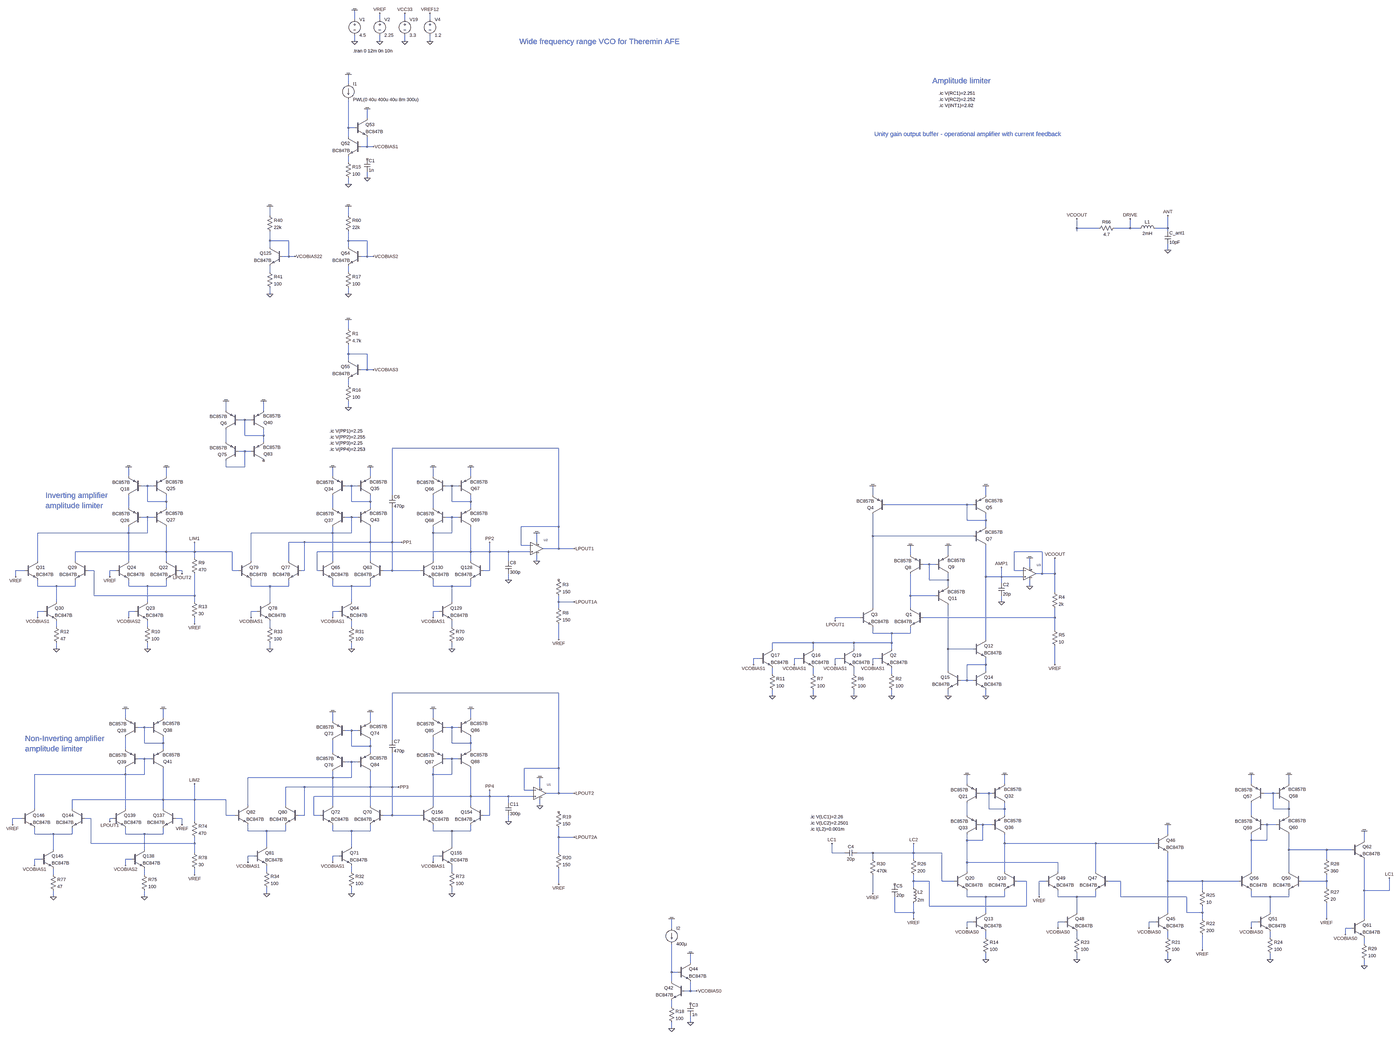
[diagram p0: schematic vco_sine_bjt_v09.asc, whole sheet]
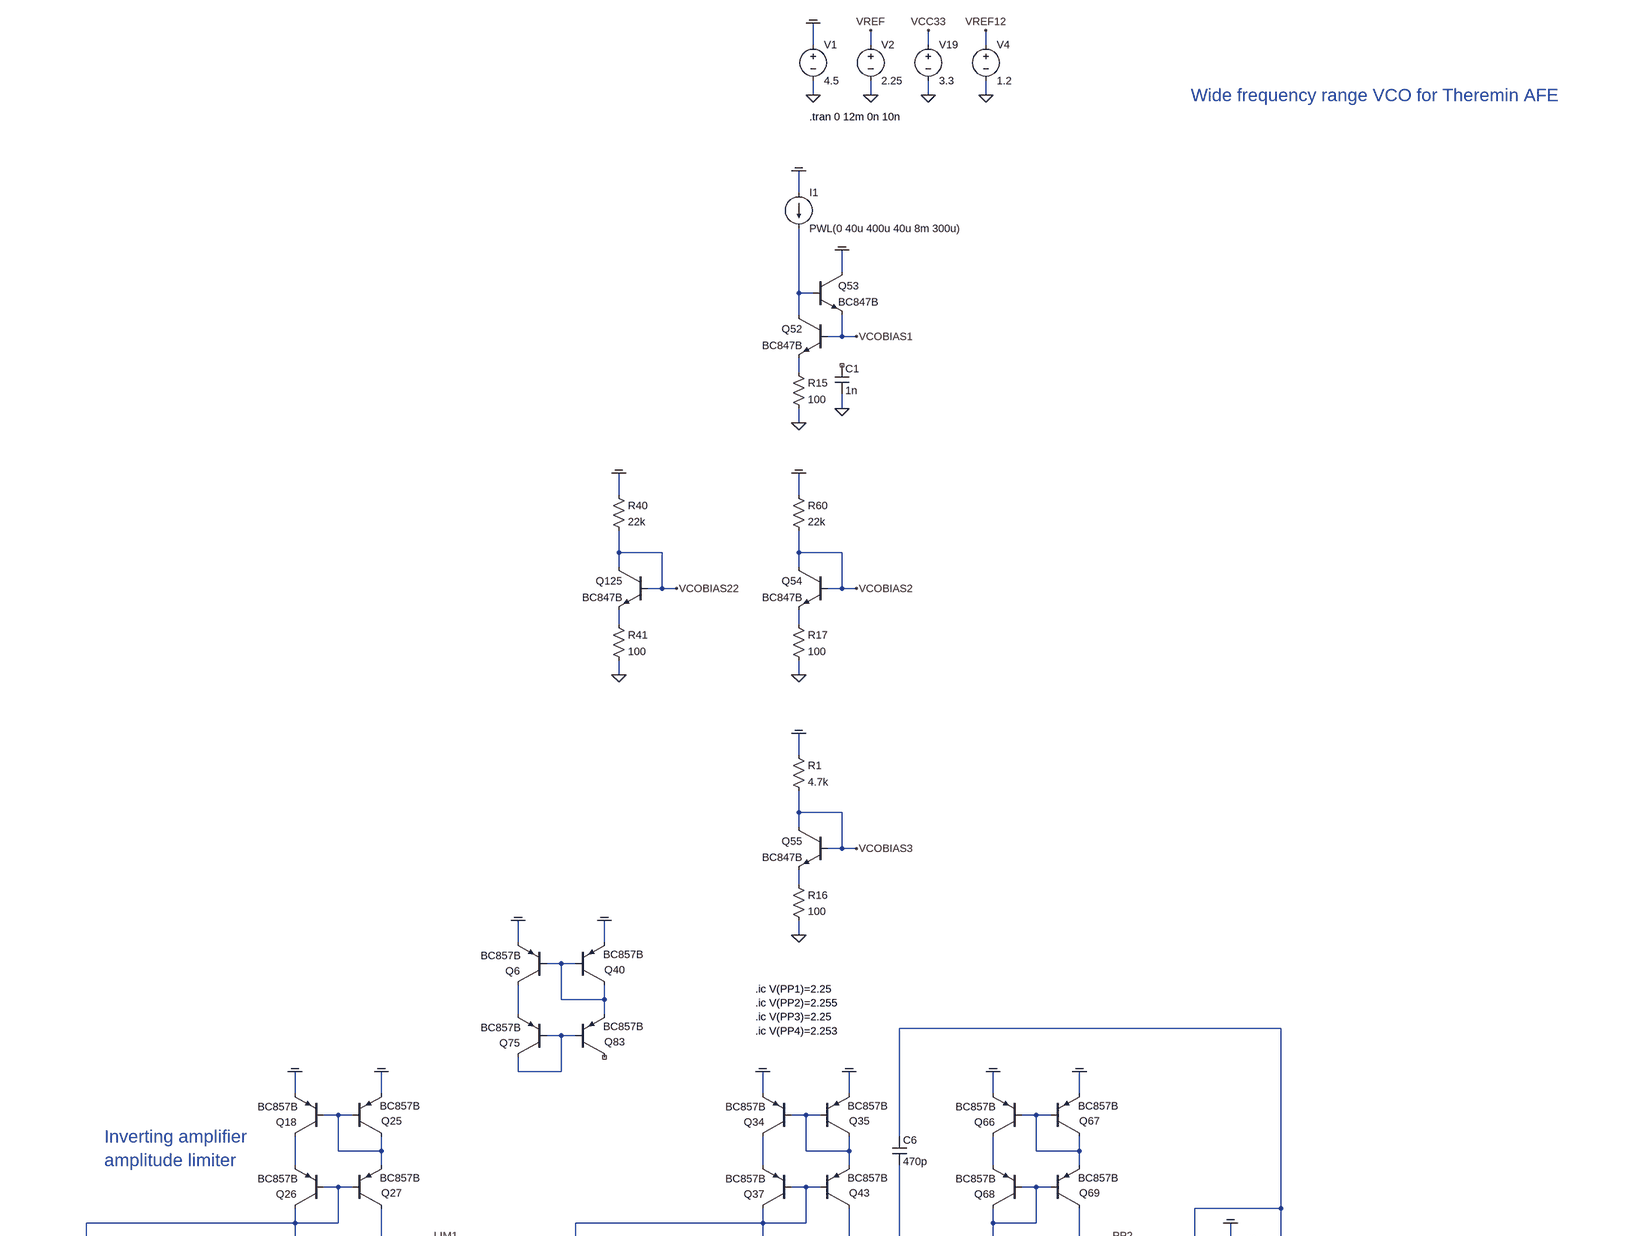
[diagram p1: schematic vco_sine_bjt_v09.asc, part, row 1 of 2, column 1 of 2]
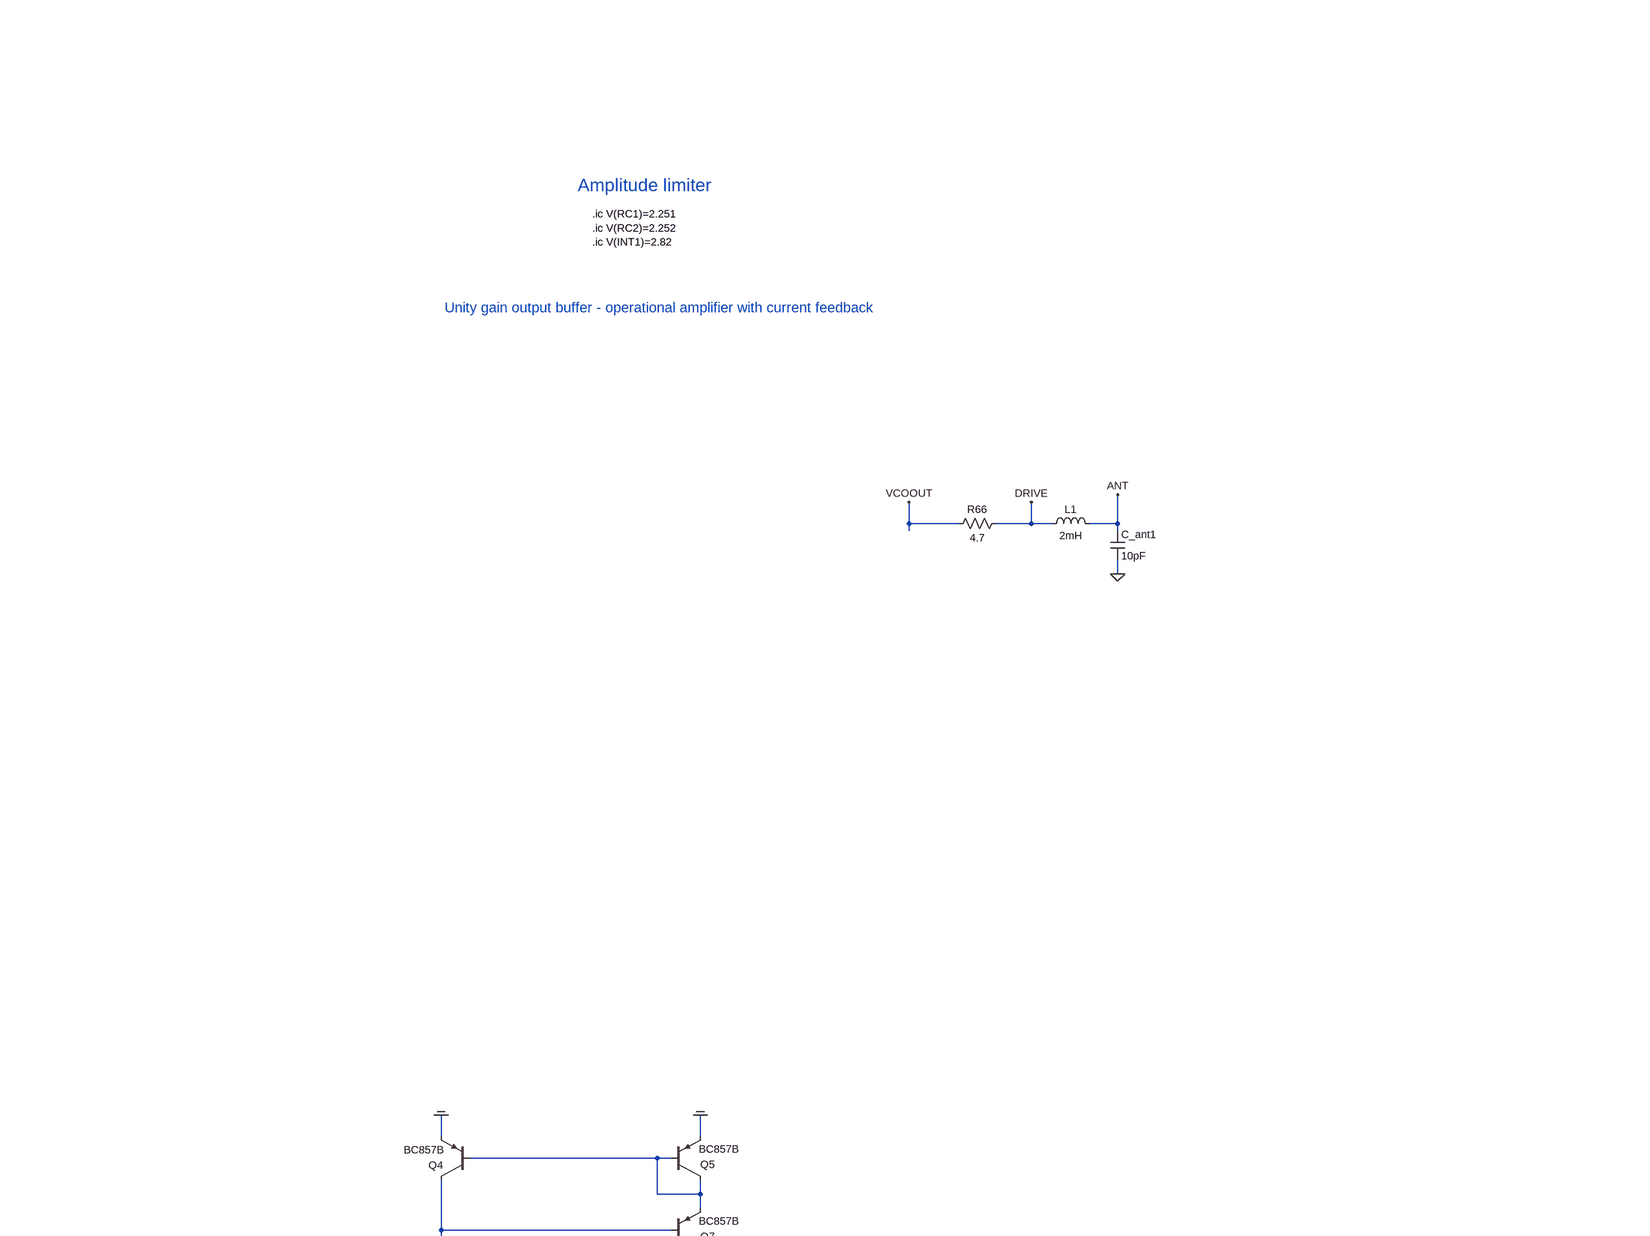
[diagram p2: schematic vco_sine_bjt_v09.asc, part, row 1 of 2, column 2 of 2]
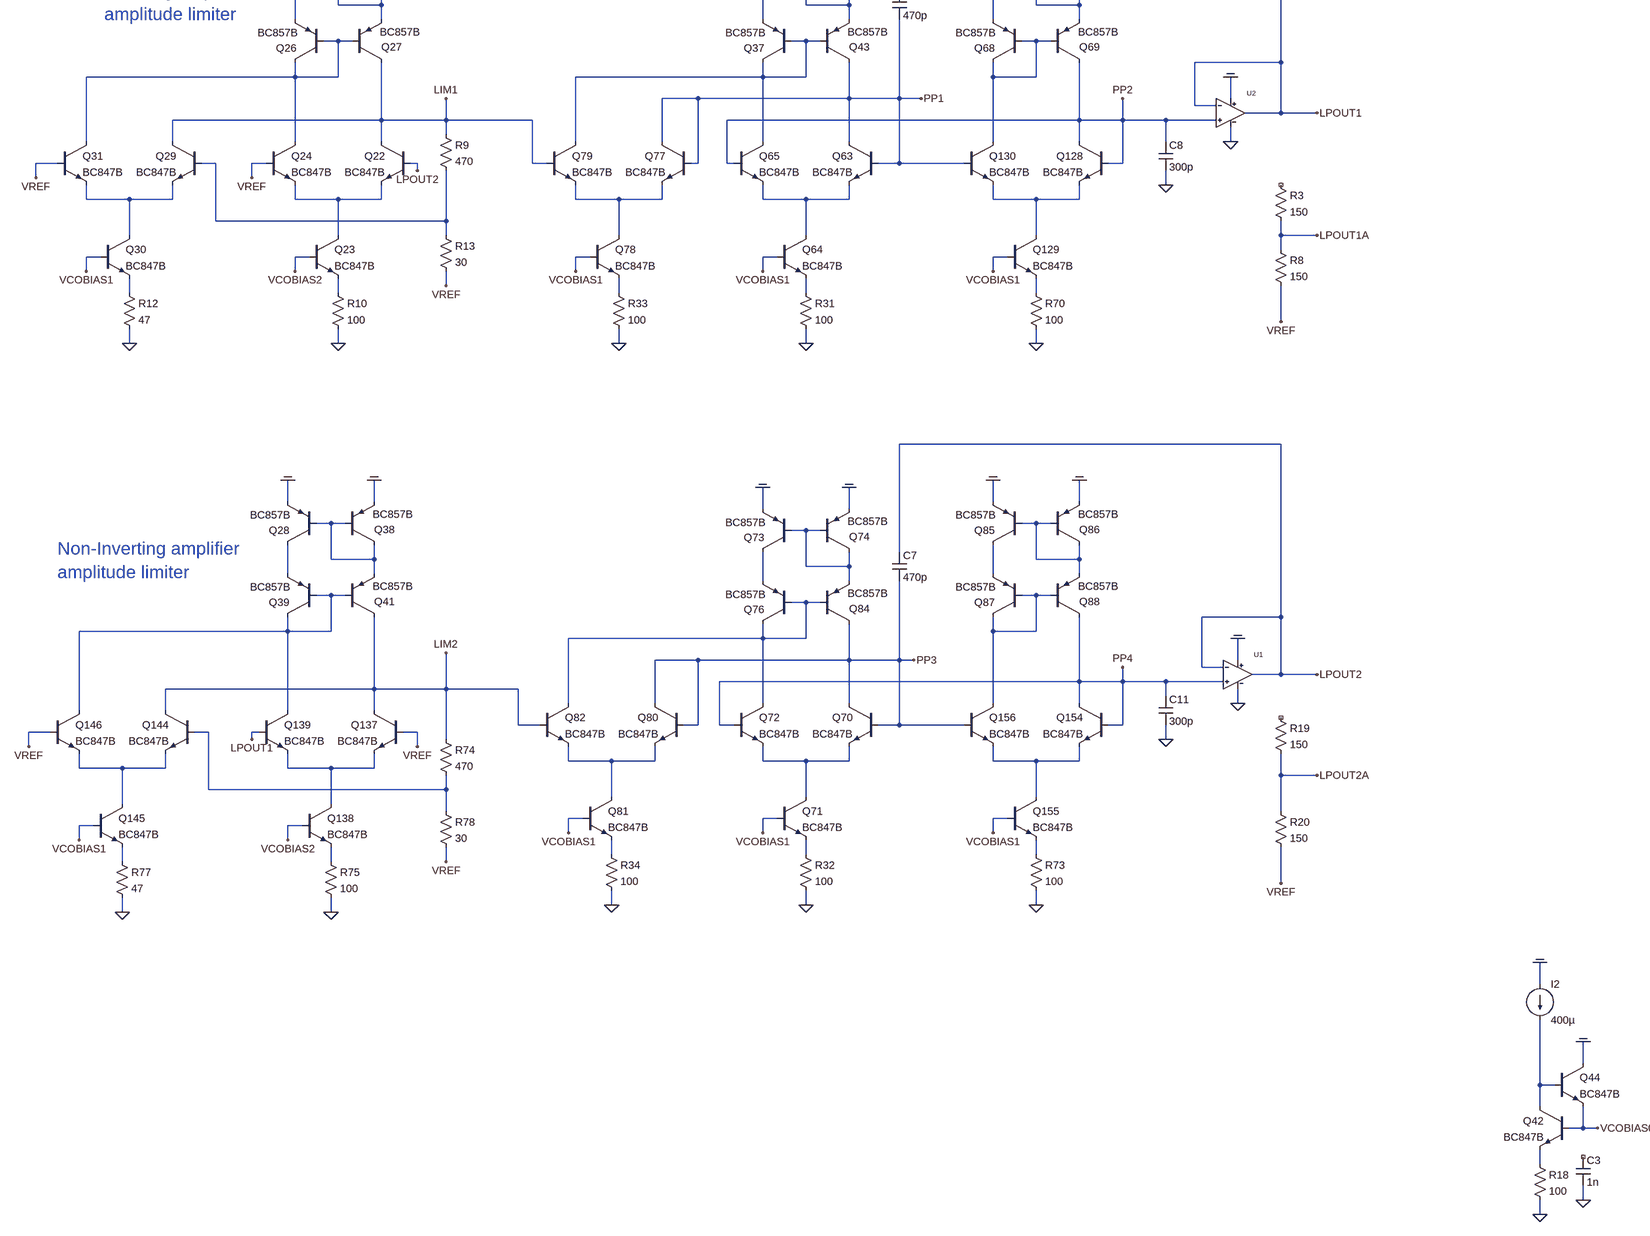
[diagram p3: schematic vco_sine_bjt_v09.asc, part, row 2 of 2, column 1 of 2]
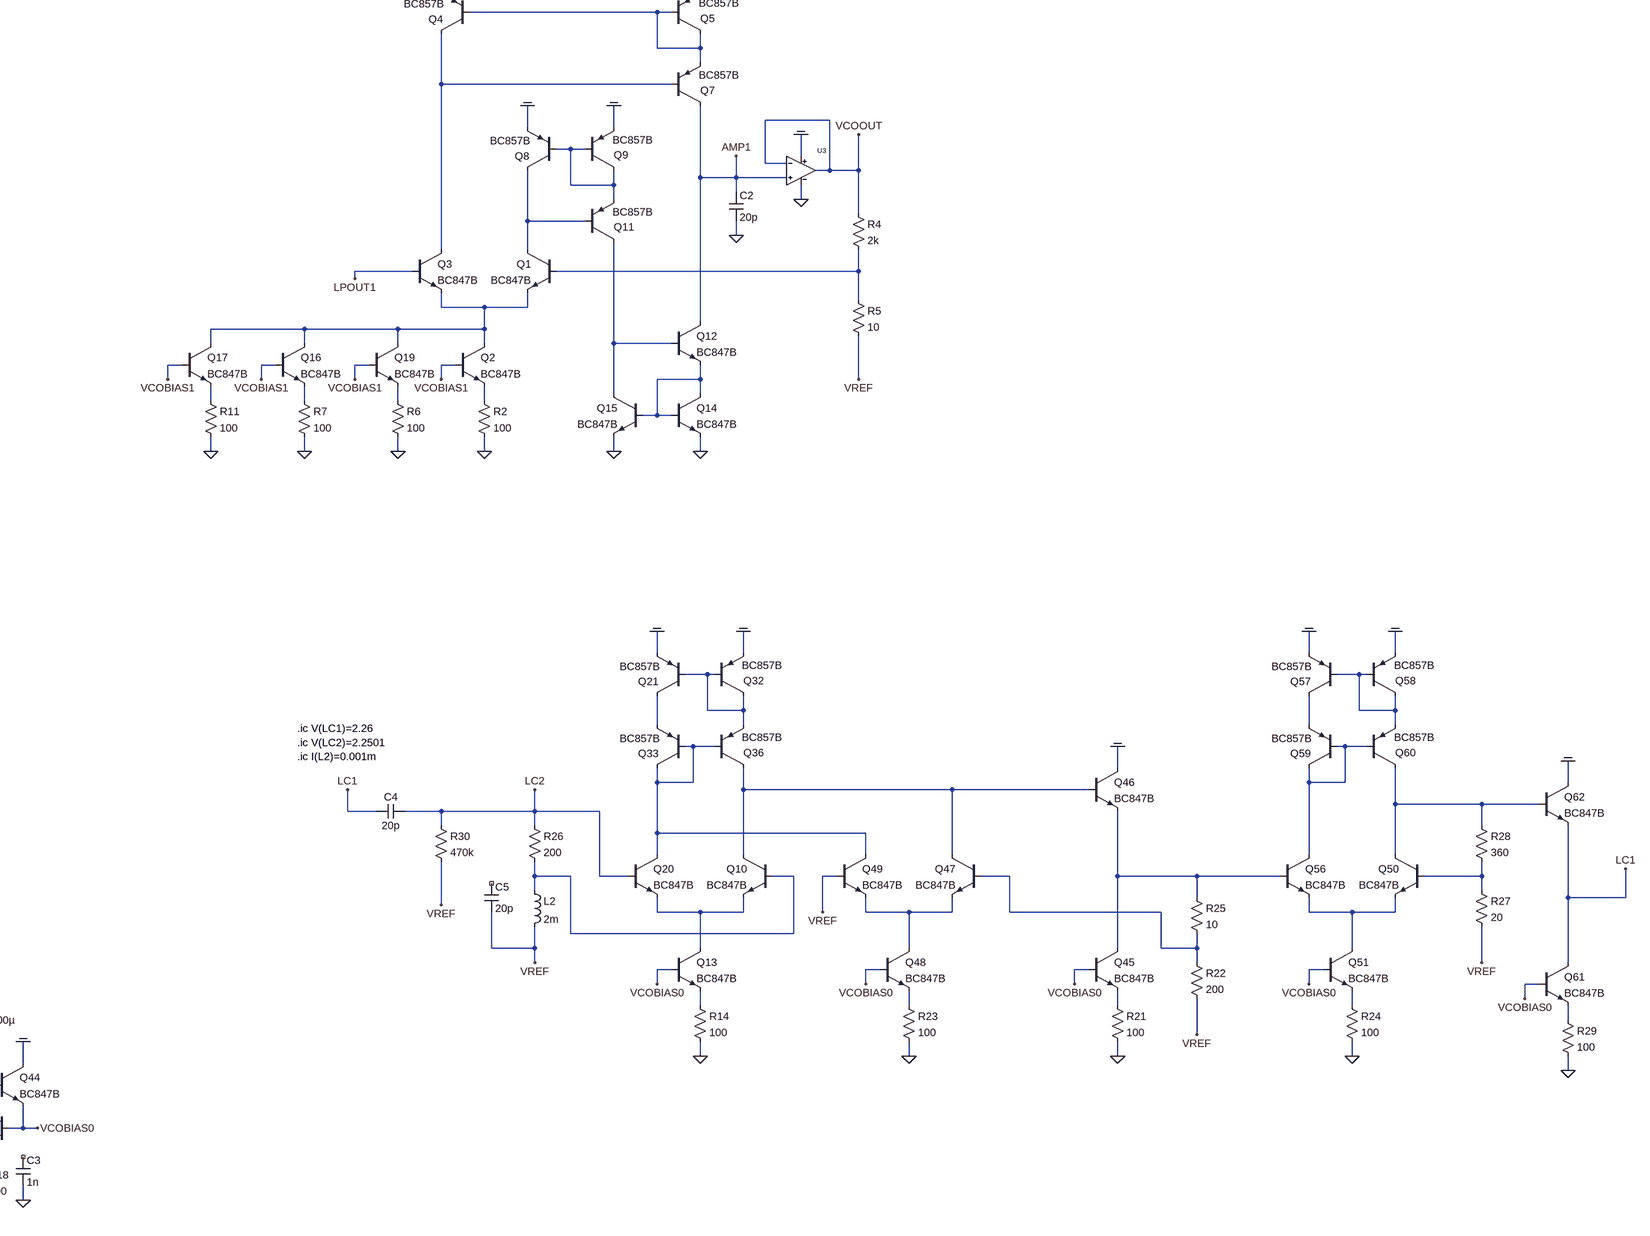
[diagram p4: schematic vco_sine_bjt_v09.asc, part, row 2 of 2, column 2 of 2]
vco_sine_bjt_v09.asc, the LTspice schematic file:
Version 4
SHEET 1 13504 19328
WIRE -432 13600 -432 13552
WIRE -304 13600 -304 13568
WIRE -176 13600 -176 13568
WIRE -48 13600 -48 13568
WIRE -432 13712 -432 13680
WIRE -304 13712 -304 13680
WIRE -176 13712 -176 13680
WIRE -48 13712 -48 13680
WIRE -464 14000 -464 13952
WIRE -368 14176 -368 14128
WIRE -464 14224 -464 14080
WIRE -432 14224 -464 14224
WIRE -464 14272 -464 14224
WIRE -368 14320 -368 14272
WIRE -368 14320 -400 14320
WIRE -336 14320 -368 14320
WIRE -464 14400 -464 14368
WIRE -368 14480 -368 14448
WIRE -464 14512 -464 14480
WIRE -864 14672 -864 14624
WIRE -464 14672 -464 14624
WIRE 3536 14736 3536 14688
WIRE 3648 14736 3536 14736
WIRE 3808 14736 3808 14688
WIRE 3808 14736 3728 14736
WIRE 3856 14736 3808 14736
WIRE 4000 14736 4000 14672
WIRE 4000 14736 3936 14736
WIRE 3536 14752 3536 14736
WIRE 4000 14752 4000 14736
WIRE -864 14800 -864 14752
WIRE -768 14800 -864 14800
WIRE -464 14800 -464 14752
WIRE -368 14800 -464 14800
WIRE -864 14832 -864 14800
WIRE -464 14832 -464 14800
WIRE 4000 14848 4000 14816
WIRE -768 14880 -768 14800
WIRE -768 14880 -800 14880
WIRE -736 14880 -768 14880
WIRE -368 14880 -368 14800
WIRE -368 14880 -400 14880
WIRE -336 14880 -368 14880
WIRE -864 14960 -864 14928
WIRE -464 14960 -464 14928
WIRE -864 15072 -864 15040
WIRE -464 15072 -464 15040
WIRE -464 15280 -464 15232
WIRE -464 15408 -464 15360
WIRE -368 15408 -464 15408
WIRE -464 15440 -464 15408
WIRE -368 15488 -368 15408
WIRE -368 15488 -400 15488
WIRE -336 15488 -368 15488
WIRE -464 15568 -464 15536
WIRE -464 15680 -464 15648
WIRE -1088 15696 -1088 15648
WIRE -896 15696 -896 15648
WIRE -992 15744 -1024 15744
WIRE -960 15744 -992 15744
WIRE -992 15824 -992 15744
WIRE -896 15824 -896 15792
WIRE -896 15824 -992 15824
WIRE -1088 15856 -1088 15792
WIRE -896 15856 -896 15824
WIRE 608 15888 -240 15888
WIRE -992 15904 -1024 15904
WIRE -960 15904 -992 15904
WIRE -1088 15984 -1088 15952
WIRE -992 15984 -992 15904
WIRE -992 15984 -1088 15984
WIRE -1584 16032 -1584 15984
WIRE -1392 16032 -1392 15984
WIRE -544 16032 -544 15984
WIRE -352 16032 -352 15984
WIRE -32 16032 -32 15984
WIRE 160 16032 160 15984
WIRE -1488 16080 -1520 16080
WIRE -1456 16080 -1488 16080
WIRE -448 16080 -480 16080
WIRE -416 16080 -448 16080
WIRE 64 16080 32 16080
WIRE 96 16080 64 16080
WIRE -240 16128 -240 15888
WIRE 2496 16128 2496 16080
WIRE 3072 16128 3072 16080
WIRE -1488 16160 -1488 16080
WIRE -1392 16160 -1392 16128
WIRE -1392 16160 -1488 16160
WIRE -448 16160 -448 16080
WIRE -352 16160 -352 16128
WIRE -352 16160 -448 16160
WIRE 64 16160 64 16080
WIRE 160 16160 160 16128
WIRE 160 16160 64 16160
WIRE 2976 16176 2560 16176
WIRE 3008 16176 2976 16176
WIRE -1584 16192 -1584 16128
WIRE -1392 16192 -1392 16160
WIRE -544 16192 -544 16128
WIRE -352 16192 -352 16160
WIRE -32 16192 -32 16128
WIRE 160 16192 160 16160
WIRE -1488 16240 -1520 16240
WIRE -1456 16240 -1488 16240
WIRE -448 16240 -480 16240
WIRE -416 16240 -448 16240
WIRE 64 16240 32 16240
WIRE 96 16240 64 16240
WIRE 2976 16256 2976 16176
WIRE 3072 16256 3072 16224
WIRE 3072 16256 2976 16256
WIRE 608 16288 608 15888
WIRE 608 16288 416 16288
WIRE 3072 16288 3072 16256
WIRE -1584 16320 -1584 16288
WIRE -1584 16320 -2048 16320
WIRE -1488 16320 -1488 16240
WIRE -1488 16320 -1584 16320
WIRE -544 16320 -544 16288
WIRE -544 16320 -960 16320
WIRE -448 16320 -448 16240
WIRE -448 16320 -544 16320
WIRE -32 16320 -32 16288
WIRE 64 16320 64 16240
WIRE 64 16320 -32 16320
WIRE 2496 16336 2496 16224
WIRE 3008 16336 2496 16336
WIRE -688 16368 -768 16368
WIRE -352 16368 -352 16288
WIRE -352 16368 -688 16368
WIRE -240 16368 -240 16192
WIRE -240 16368 -352 16368
WIRE -192 16368 -240 16368
WIRE 496 16368 496 16320
WIRE 416 16384 416 16288
WIRE 464 16384 416 16384
WIRE 608 16400 608 16288
WIRE 608 16400 528 16400
WIRE 688 16400 608 16400
WIRE -1392 16416 -1392 16288
WIRE -1392 16416 -1856 16416
WIRE -1248 16416 -1248 16368
WIRE -1248 16416 -1392 16416
WIRE -1056 16416 -1248 16416
WIRE 160 16416 160 16288
WIRE 160 16416 -624 16416
WIRE 256 16416 256 16368
WIRE 256 16416 160 16416
WIRE 352 16416 256 16416
WIRE 464 16416 352 16416
WIRE 3360 16416 3216 16416
WIRE 2688 16432 2688 16384
WIRE 2880 16432 2880 16384
WIRE -1248 16448 -1248 16416
WIRE -2048 16464 -2048 16320
WIRE -1856 16464 -1856 16416
WIRE -1584 16464 -1584 16320
WIRE -1392 16464 -1392 16416
WIRE -960 16464 -960 16320
WIRE -768 16464 -768 16368
WIRE -544 16464 -544 16320
WIRE -352 16464 -352 16368
WIRE -32 16464 -32 16320
WIRE 160 16464 160 16416
WIRE 352 16464 352 16416
WIRE 496 16464 496 16432
WIRE 2784 16480 2752 16480
WIRE 2816 16480 2784 16480
WIRE 3296 16496 3296 16448
WIRE -2112 16512 -2160 16512
WIRE -1760 16512 -1792 16512
WIRE -1648 16512 -1680 16512
WIRE -1312 16512 -1328 16512
WIRE -1056 16512 -1056 16416
WIRE -1024 16512 -1056 16512
WIRE -688 16512 -688 16368
WIRE -688 16512 -704 16512
WIRE -624 16512 -624 16416
WIRE -608 16512 -624 16512
WIRE -240 16512 -240 16368
WIRE -240 16512 -288 16512
WIRE -96 16512 -240 16512
WIRE 256 16512 256 16416
WIRE 256 16512 224 16512
WIRE 3216 16512 3216 16416
WIRE 3264 16512 3216 16512
WIRE -1312 16528 -1312 16512
WIRE 3360 16528 3360 16416
WIRE 3360 16528 3328 16528
WIRE 3424 16528 3424 16448
WIRE 3424 16528 3360 16528
WIRE -2160 16544 -2160 16512
WIRE -1680 16544 -1680 16512
WIRE 3072 16544 3072 16384
WIRE 3152 16544 3152 16496
WIRE 3152 16544 3072 16544
WIRE 3264 16544 3152 16544
WIRE 352 16560 352 16528
WIRE 2784 16560 2784 16480
WIRE 2880 16560 2880 16528
WIRE 2880 16560 2784 16560
WIRE 3152 16576 3152 16544
WIRE -2048 16592 -2048 16560
WIRE -1952 16592 -2048 16592
WIRE -1856 16592 -1856 16560
WIRE -1856 16592 -1952 16592
WIRE -1584 16592 -1584 16560
WIRE -1488 16592 -1584 16592
WIRE -1392 16592 -1392 16560
WIRE -1392 16592 -1488 16592
WIRE -960 16592 -960 16560
WIRE -864 16592 -960 16592
WIRE -768 16592 -768 16560
WIRE -768 16592 -864 16592
WIRE -544 16592 -544 16560
WIRE -448 16592 -544 16592
WIRE -352 16592 -352 16560
WIRE -352 16592 -448 16592
WIRE -32 16592 -32 16560
WIRE 64 16592 -32 16592
WIRE 160 16592 160 16560
WIRE 160 16592 64 16592
WIRE 2880 16592 2880 16560
WIRE 3296 16592 3296 16560
WIRE 3424 16624 3424 16528
WIRE -1760 16640 -1760 16512
WIRE -1248 16640 -1248 16528
WIRE -1248 16640 -1760 16640
WIRE 2688 16640 2688 16528
WIRE 2816 16640 2688 16640
WIRE -1952 16672 -1952 16592
WIRE -1488 16672 -1488 16592
WIRE -1248 16672 -1248 16640
WIRE -864 16672 -864 16592
WIRE -448 16672 -448 16592
WIRE 64 16672 64 16592
WIRE 608 16672 608 16640
WIRE 688 16672 608 16672
WIRE 3152 16672 3152 16640
WIRE 608 16704 608 16672
WIRE 2496 16704 2496 16336
WIRE 2688 16704 2688 16640
WIRE -2016 16720 -2048 16720
WIRE -1552 16720 -1584 16720
WIRE -928 16720 -960 16720
WIRE -512 16720 -544 16720
WIRE 0 16720 -32 16720
WIRE -2048 16752 -2048 16720
WIRE -1584 16752 -1584 16720
WIRE -960 16752 -960 16720
WIRE -544 16752 -544 16720
WIRE -32 16752 -32 16720
WIRE 2432 16752 2304 16752
WIRE 3424 16752 3424 16704
WIRE 3424 16752 2752 16752
WIRE 2304 16768 2304 16752
WIRE -1248 16784 -1248 16752
WIRE -1952 16800 -1952 16768
WIRE -1488 16800 -1488 16768
WIRE -864 16800 -864 16768
WIRE -448 16800 -448 16768
WIRE 64 16800 64 16768
WIRE 3424 16816 3424 16752
WIRE 2496 16832 2496 16800
WIRE 2592 16832 2496 16832
WIRE 2688 16832 2688 16800
WIRE 2688 16832 2592 16832
WIRE 608 16864 608 16784
WIRE 3072 16864 3072 16544
WIRE 2192 16880 1984 16880
WIRE 2400 16880 2192 16880
WIRE 2592 16880 2592 16832
WIRE 2592 16880 2400 16880
WIRE -1952 16912 -1952 16880
WIRE -1488 16912 -1488 16880
WIRE -864 16912 -864 16880
WIRE -448 16912 -448 16880
WIRE 64 16912 64 16880
WIRE 1984 16912 1984 16880
WIRE 2192 16912 2192 16880
WIRE 2400 16912 2400 16880
WIRE 2592 16912 2592 16880
WIRE 2880 16912 2880 16688
WIRE 3008 16912 2880 16912
WIRE 1920 16960 1888 16960
WIRE 2128 16960 2096 16960
WIRE 2336 16960 2304 16960
WIRE 2528 16960 2496 16960
WIRE 1888 16992 1888 16960
WIRE 2096 16992 2096 16960
WIRE 2304 16992 2304 16960
WIRE 2496 16992 2496 16960
WIRE 3072 16992 3072 16960
WIRE 3072 16992 2976 16992
WIRE 3424 16992 3424 16896
WIRE 2880 17024 2880 16912
WIRE 3072 17024 3072 16992
WIRE 1984 17040 1984 17008
WIRE 2192 17040 2192 17008
WIRE 2400 17040 2400 17008
WIRE 2592 17040 2592 17008
WIRE 2976 17072 2976 16992
WIRE 2976 17072 2944 17072
WIRE 3008 17072 2976 17072
WIRE 608 17136 -240 17136
WIRE 1984 17152 1984 17120
WIRE 2192 17152 2192 17120
WIRE 2400 17152 2400 17120
WIRE 2592 17152 2592 17120
WIRE 2880 17152 2880 17120
WIRE 3072 17152 3072 17120
WIRE -1600 17264 -1600 17216
WIRE -1408 17264 -1408 17216
WIRE -32 17264 -32 17216
WIRE 160 17264 160 17216
WIRE -544 17280 -544 17232
WIRE -352 17280 -352 17232
WIRE -1504 17312 -1536 17312
WIRE -1472 17312 -1504 17312
WIRE 64 17312 32 17312
WIRE 96 17312 64 17312
WIRE -448 17328 -480 17328
WIRE -416 17328 -448 17328
WIRE -240 17376 -240 17136
WIRE -1504 17392 -1504 17312
WIRE -1408 17392 -1408 17360
WIRE -1408 17392 -1504 17392
WIRE 64 17392 64 17312
WIRE 160 17392 160 17360
WIRE 160 17392 64 17392
WIRE -448 17408 -448 17328
WIRE -352 17408 -352 17376
WIRE -352 17408 -448 17408
WIRE -1600 17424 -1600 17360
WIRE -1408 17424 -1408 17392
WIRE -32 17424 -32 17360
WIRE 160 17424 160 17392
WIRE -544 17440 -544 17376
WIRE -352 17440 -352 17408
WIRE -1504 17472 -1536 17472
WIRE -1472 17472 -1504 17472
WIRE 64 17472 32 17472
WIRE 96 17472 64 17472
WIRE -448 17488 -480 17488
WIRE -416 17488 -448 17488
WIRE 608 17520 608 17136
WIRE 608 17520 432 17520
WIRE -1600 17552 -1600 17520
WIRE -1600 17552 -2064 17552
WIRE -1504 17552 -1504 17472
WIRE -1504 17552 -1600 17552
WIRE -32 17552 -32 17520
WIRE 64 17552 64 17472
WIRE 64 17552 -32 17552
WIRE -544 17568 -544 17536
WIRE -544 17568 -976 17568
WIRE -448 17568 -448 17488
WIRE -448 17568 -544 17568
WIRE 2976 17600 2976 17552
WIRE 3168 17600 3168 17552
WIRE 4432 17600 4432 17552
WIRE 4624 17600 4624 17552
WIRE -688 17616 -784 17616
WIRE -352 17616 -352 17536
WIRE -352 17616 -688 17616
WIRE -240 17616 -240 17440
WIRE -240 17616 -352 17616
WIRE -208 17616 -240 17616
WIRE 512 17616 512 17568
WIRE 432 17632 432 17520
WIRE 480 17632 432 17632
WIRE 608 17648 608 17520
WIRE 608 17648 544 17648
WIRE 688 17648 608 17648
WIRE 3088 17648 3040 17648
WIRE 3104 17648 3088 17648
WIRE 4544 17648 4496 17648
WIRE 4560 17648 4544 17648
WIRE 160 17664 160 17520
WIRE 160 17664 -640 17664
WIRE 256 17664 256 17632
WIRE 256 17664 160 17664
WIRE 352 17664 256 17664
WIRE 480 17664 352 17664
WIRE -1408 17680 -1408 17520
WIRE -1408 17680 -1872 17680
WIRE -1248 17680 -1248 17600
WIRE -1248 17680 -1408 17680
WIRE -1088 17680 -1248 17680
WIRE 352 17696 352 17664
WIRE -976 17712 -976 17568
WIRE -784 17712 -784 17616
WIRE -544 17712 -544 17568
WIRE -352 17712 -352 17616
WIRE -32 17712 -32 17552
WIRE 160 17712 160 17664
WIRE 512 17712 512 17680
WIRE -2064 17728 -2064 17552
WIRE -1872 17728 -1872 17680
WIRE -1600 17728 -1600 17552
WIRE -1408 17728 -1408 17680
WIRE 3088 17728 3088 17648
WIRE 3168 17728 3168 17696
WIRE 3168 17728 3088 17728
WIRE 4544 17728 4544 17648
WIRE 4624 17728 4624 17696
WIRE 4624 17728 4544 17728
WIRE -1088 17760 -1088 17680
WIRE -1040 17760 -1088 17760
WIRE -688 17760 -688 17616
WIRE -688 17760 -720 17760
WIRE -640 17760 -640 17664
WIRE -608 17760 -640 17760
WIRE -240 17760 -240 17616
WIRE -240 17760 -288 17760
WIRE -96 17760 -240 17760
WIRE 256 17760 256 17664
WIRE 256 17760 224 17760
WIRE 2976 17760 2976 17696
WIRE 3168 17760 3168 17728
WIRE 4432 17760 4432 17696
WIRE 4624 17760 4624 17728
WIRE -2128 17776 -2176 17776
WIRE -1776 17776 -1808 17776
WIRE -1664 17776 -1680 17776
WIRE -1312 17776 -1344 17776
WIRE -1680 17792 -1680 17776
WIRE -1248 17792 -1248 17680
WIRE 352 17792 352 17760
WIRE -2176 17808 -2176 17776
WIRE -1312 17808 -1312 17776
WIRE 3056 17808 3040 17808
WIRE 3104 17808 3056 17808
WIRE 4512 17808 4496 17808
WIRE 4560 17808 4512 17808
WIRE -976 17840 -976 17808
WIRE -880 17840 -976 17840
WIRE -784 17840 -784 17808
WIRE -784 17840 -880 17840
WIRE -544 17840 -544 17808
WIRE -448 17840 -544 17840
WIRE -352 17840 -352 17808
WIRE -352 17840 -448 17840
WIRE -32 17840 -32 17808
WIRE 64 17840 -32 17840
WIRE 160 17840 160 17808
WIRE 160 17840 64 17840
WIRE -2064 17856 -2064 17824
WIRE -1968 17856 -2064 17856
WIRE -1872 17856 -1872 17824
WIRE -1872 17856 -1968 17856
WIRE -1600 17856 -1600 17824
WIRE -1504 17856 -1600 17856
WIRE -1408 17856 -1408 17824
WIRE -1408 17856 -1504 17856
WIRE 4000 17856 4000 17808
WIRE 608 17872 608 17824
WIRE 688 17872 608 17872
WIRE 2976 17888 2976 17856
WIRE 3056 17888 3056 17808
WIRE 3056 17888 2976 17888
WIRE 4432 17888 4432 17856
WIRE 4512 17888 4512 17808
WIRE 4512 17888 4432 17888
WIRE 5008 17888 5008 17840
WIRE -1776 17904 -1776 17776
WIRE -1248 17904 -1248 17872
WIRE -1248 17904 -1776 17904
WIRE 3168 17904 3168 17856
WIRE 3632 17904 3168 17904
WIRE 3936 17904 3632 17904
WIRE -880 17920 -880 17840
WIRE -448 17920 -448 17840
WIRE 64 17920 64 17840
WIRE -1968 17936 -1968 17856
WIRE -1504 17936 -1504 17856
WIRE 4624 17936 4624 17856
WIRE 4816 17936 4624 17936
WIRE 4944 17936 4816 17936
WIRE -1248 17952 -1248 17904
WIRE 608 17952 608 17872
WIRE 2288 17952 2288 17904
WIRE 2352 17952 2288 17952
WIRE 2496 17952 2416 17952
WIRE 2704 17952 2704 17904
WIRE 2704 17952 2496 17952
WIRE 2848 17952 2704 17952
WIRE -944 17968 -976 17968
WIRE -512 17968 -544 17968
WIRE 0 17968 -32 17968
WIRE -2032 17984 -2064 17984
WIRE -1568 17984 -1600 17984
WIRE 2496 17984 2496 17952
WIRE 2704 17984 2704 17952
WIRE 4816 17984 4816 17936
WIRE -976 18000 -976 17968
WIRE -544 18000 -544 17968
WIRE -32 18000 -32 17968
WIRE 2976 18000 2976 17888
WIRE 3440 18000 2976 18000
WIRE -2064 18016 -2064 17984
WIRE -1600 18016 -1600 17984
WIRE -880 18048 -880 18016
WIRE -448 18048 -448 18016
WIRE 64 18048 64 18016
WIRE 2976 18048 2976 18000
WIRE 3168 18048 3168 17904
WIRE 3440 18048 3440 18000
WIRE 3632 18048 3632 17904
WIRE 4432 18048 4432 17888
WIRE 4624 18048 4624 17936
WIRE -1968 18064 -1968 18032
WIRE -1504 18064 -1504 18032
WIRE -1248 18064 -1248 18032
WIRE 2704 18096 2704 18064
WIRE 2784 18096 2704 18096
WIRE 2848 18096 2848 17952
WIRE 2912 18096 2848 18096
WIRE 3280 18096 3232 18096
WIRE 3376 18096 3344 18096
WIRE 3760 18096 3696 18096
WIRE 4000 18096 4000 17952
WIRE 4176 18096 4000 18096
WIRE 4368 18096 4176 18096
WIRE 4816 18096 4816 18064
WIRE 4816 18096 4688 18096
WIRE 608 18112 608 18032
WIRE 2704 18128 2704 18096
WIRE 4816 18128 4816 18096
WIRE 4176 18144 4176 18096
WIRE 5008 18144 5008 17984
WIRE 5136 18144 5136 18080
WIRE 5136 18144 5008 18144
WIRE -880 18160 -880 18128
WIRE -448 18160 -448 18128
WIRE 64 18160 64 18128
WIRE 2496 18160 2496 18064
WIRE -1968 18176 -1968 18144
WIRE -1504 18176 -1504 18144
WIRE 2976 18176 2976 18144
WIRE 3072 18176 2976 18176
WIRE 3168 18176 3168 18144
WIRE 3168 18176 3072 18176
WIRE 3344 18176 3344 18096
WIRE 3440 18176 3440 18144
WIRE 3536 18176 3440 18176
WIRE 3632 18176 3632 18144
WIRE 3632 18176 3536 18176
WIRE 3760 18176 3760 18096
WIRE 4096 18176 3760 18176
WIRE 4432 18176 4432 18144
WIRE 4528 18176 4432 18176
WIRE 4624 18176 4624 18144
WIRE 4624 18176 4528 18176
WIRE 2784 18224 2784 18096
WIRE 3280 18224 3280 18096
WIRE 3280 18224 2784 18224
WIRE 2608 18256 2608 18176
WIRE 2704 18256 2704 18208
WIRE 2704 18256 2608 18256
WIRE 3072 18256 3072 18176
WIRE 3536 18256 3536 18176
WIRE 4000 18256 4000 18096
WIRE 4096 18256 4096 18176
WIRE 4176 18256 4176 18224
WIRE 4176 18256 4096 18256
WIRE 4528 18256 4528 18176
WIRE 2704 18288 2704 18256
WIRE 4176 18288 4176 18256
WIRE 4816 18288 4816 18208
WIRE 5008 18288 5008 18144
WIRE 3008 18304 2976 18304
WIRE 3472 18304 3440 18304
WIRE 3936 18304 3904 18304
WIRE 4464 18304 4432 18304
WIRE 1184 18336 1184 18288
WIRE 2976 18336 2976 18304
WIRE 3440 18336 3440 18304
WIRE 3904 18336 3904 18304
WIRE 4432 18336 4432 18304
WIRE 4944 18336 4912 18336
WIRE 4912 18368 4912 18336
WIRE 3072 18384 3072 18352
WIRE 3536 18384 3536 18352
WIRE 4000 18384 4000 18352
WIRE 4528 18384 4528 18352
WIRE 5008 18416 5008 18384
WIRE 4176 18448 4176 18368
WIRE 3072 18496 3072 18464
WIRE 3536 18496 3536 18464
WIRE 4000 18496 4000 18464
WIRE 4528 18496 4528 18464
WIRE 1280 18512 1280 18464
WIRE 5008 18528 5008 18496
WIRE 1184 18560 1184 18416
WIRE 1216 18560 1184 18560
WIRE 1184 18608 1184 18560
WIRE 1280 18656 1280 18608
WIRE 1280 18656 1248 18656
WIRE 1312 18656 1280 18656
WIRE 1184 18736 1184 18704
WIRE 1280 18816 1280 18784
WIRE 1184 18848 1184 18816
FLAG -432 13712 0
FLAG -432 13552 COM
FLAG -304 13712 0
FLAG -304 13568 VREF
FLAG -176 13712 0
FLAG -176 13568 VCC33
FLAG -48 13712 0
FLAG -48 13568 VREF12
FLAG -336 14320 VCOBIAS1
FLAG -464 14624 COM
FLAG -464 15232 COM
FLAG -464 13952 COM
FLAG -336 14880 VCOBIAS2
FLAG -336 15488 VCOBIAS3
FLAG -368 14128 COM
FLAG -464 14512 0
FLAG -464 15680 0
FLAG -464 15072 0
FLAG -368 14480 0
FLAG -864 14624 COM
FLAG -736 14880 VCOBIAS22
FLAG -864 15072 0
FLAG 4000 14848 0
FLAG 4000 14672 ANT
FLAG 3808 14688 DRIVE
FLAG 3536 14688 VCOOUT
FLAG -32 16752 VCOBIAS1
FLAG 64 16912 0
FLAG 352 16560 0
FLAG -1600 18016 VCOBIAS2
FLAG -1248 18064 VREF
FLAG -1248 17600 LIM2
FLAG -1504 18176 0
FLAG -2064 18016 VCOBIAS1
FLAG -1968 18176 0
FLAG -32 18000 VCOBIAS1
FLAG 64 18160 0
FLAG 352 17792 0
FLAG 256 16368 PP2
FLAG 256 17632 PP4
FLAG 2496 16992 VCOBIAS1
FLAG 2592 17152 0
FLAG 2496 16080 COM
FLAG 3072 16080 COM
FLAG 2688 16384 COM
FLAG 2880 16384 COM
FLAG 2880 17152 0
FLAG 3072 17152 0
FLAG 3152 16672 0
FLAG 3152 16496 AMP1
FLAG 2304 16768 LPOUT1
FLAG 3424 16992 VREF
FLAG 2304 16992 VCOBIAS1
FLAG 2400 17152 0
FLAG 3424 16448 VCOOUT
FLAG -1584 16752 VCOBIAS2
FLAG -1248 16784 VREF
FLAG -1248 16368 LIM1
FLAG -1488 16912 0
FLAG -1680 16544 VREF
FLAG -2048 16752 VCOBIAS1
FLAG -1952 16912 0
FLAG -1312 16528 LPOUT2
FLAG -1680 17792 LPOUT1
FLAG -2160 16544 VREF
FLAG -2176 17808 VREF
FLAG -1312 17808 VREF
FLAG 688 17648 LPOUT2
FLAG 512 17712 0
FLAG 512 17568 COM
FLAG 688 16400 LPOUT1
FLAG 496 16464 0
FLAG 496 16320 COM
FLAG 3296 16592 0
FLAG 3296 16448 COM
FLAG 608 16864 VREF
FLAG 688 16672 LPOUT1A
FLAG 2096 16992 VCOBIAS1
FLAG 2192 17152 0
FLAG 1888 16992 VCOBIAS1
FLAG 1984 17152 0
FLAG 608 18112 VREF
FLAG 2976 18336 VCOBIAS0
FLAG 3072 18496 0
FLAG 2976 17552 COM
FLAG 3168 17552 COM
FLAG 1312 18656 VCOBIAS0
FLAG 1184 18288 COM
FLAG 1280 18464 COM
FLAG 1184 18848 0
FLAG 1280 18816 0
FLAG 2704 18288 VREF
FLAG 2288 17904 LC1
FLAG 2704 17904 LC2
FLAG 3904 18336 VCOBIAS0
FLAG 4000 18496 0
FLAG 4000 17808 COM
FLAG 3440 18336 VCOBIAS0
FLAG 3536 18496 0
FLAG 3344 18176 VREF
FLAG 4432 18336 VCOBIAS0
FLAG 4528 18496 0
FLAG 4432 17552 COM
FLAG 4624 17552 COM
FLAG 4816 18288 VREF
FLAG 5136 18080 LC1
FLAG 4912 18368 VCOBIAS0
FLAG 5008 18528 0
FLAG 5008 17840 COM
FLAG 4176 18448 VREF
FLAG 2496 18160 VREF
FLAG -544 16752 VCOBIAS1
FLAG -448 16912 0
FLAG -544 18000 VCOBIAS1
FLAG -448 18160 0
FLAG -960 16752 VCOBIAS1
FLAG -864 16912 0
FLAG -192 16368 PP1
FLAG -208 17616 PP3
FLAG -976 18000 VCOBIAS1
FLAG -880 18160 0
FLAG 688 17872 LPOUT2A
FLAG -1088 15648 COM
FLAG -896 15648 COM
FLAG -1584 15984 COM
FLAG -1392 15984 COM
FLAG -544 15984 COM
FLAG -352 15984 COM
FLAG -32 15984 COM
FLAG 160 15984 COM
FLAG -1600 17216 COM
FLAG -1408 17216 COM
FLAG -544 17232 COM
FLAG -352 17232 COM
FLAG -32 17216 COM
FLAG 160 17216 COM
SYMBOL voltage -432 13584 R0
SYMATTR InstName V1
SYMATTR Value 4.5
SYMBOL Voltage -304 13584 R0
SYMATTR InstName V2
SYMATTR Value 2.25
SYMBOL Voltage -176 13584 R0
SYMATTR InstName V19
SYMATTR Value 3.3
SYMBOL Voltage -48 13584 R0
SYMATTR InstName V4
SYMATTR Value 1.2
SYMBOL npn -400 14272 M0
SYMATTR InstName Q52
SYMATTR Value BC847B
SYMBOL Res -480 14656 R0
SYMATTR InstName R60
SYMATTR Value 22k
SYMBOL Res -480 15264 R0
SYMATTR InstName R1
SYMATTR Value 4.7k
SYMBOL current -464 14000 R0
SYMATTR InstName I1
SYMATTR Value PWL(0 40u 400u 40u 8m 300u)
SYMBOL npn -400 14832 M0
SYMATTR InstName Q54
SYMATTR Value BC847B
SYMBOL npn -400 15440 M0
SYMATTR InstName Q55
SYMATTR Value BC847B
SYMBOL npn -432 14176 R0
SYMATTR InstName Q53
SYMATTR Value BC847B
SYMBOL Res -480 14384 R0
SYMATTR InstName R15
SYMATTR Value 100
SYMBOL Res -480 15552 R0
SYMATTR InstName R16
SYMATTR Value 100
SYMBOL Res -480 14944 R0
SYMATTR InstName R17
SYMATTR Value 100
SYMBOL Cap -384 14384 R0
SYMATTR InstName C1
SYMATTR Value 1n
SYMBOL Res -880 14656 R0
SYMATTR InstName R40
SYMATTR Value 22k
SYMBOL npn -800 14832 M0
SYMATTR InstName Q125
SYMATTR Value BC847B
SYMBOL Res -880 14944 R0
SYMATTR InstName R41
SYMATTR Value 100
SYMBOL ind 3840 14752 R270
WINDOW 0 32 56 VTop 2
WINDOW 3 5 56 VBottom 2
SYMATTR InstName L1
SYMATTR Value 2mH
SYMATTR SpiceLine Rser=120 Cpar=1pF
SYMBOL Cap 3984 14752 R0
SYMATTR InstName C_ant1
SYMATTR Value 10pF
SYMBOL Res 3632 14752 R270
WINDOW 0 32 56 VTop 2
WINDOW 3 0 56 VBottom 2
SYMATTR InstName R66
SYMATTR Value 4.7
SYMBOL npn 224 16464 M0
SYMATTR InstName Q128
SYMATTR Value BC847B
SYMBOL npn 0 16672 R0
SYMATTR InstName Q129
SYMATTR Value BC847B
SYMBOL npn -96 16464 R0
SYMATTR InstName Q130
SYMATTR Value BC847B
SYMBOL Res 48 16784 R0
SYMATTR InstName R70
SYMATTR Value 100
SYMBOL Cap 336 16464 R0
SYMATTR InstName C8
SYMATTR Value 300p
SYMBOL npn -1344 17728 M0
SYMATTR InstName Q137
SYMATTR Value BC847B
SYMBOL npn -1568 17936 R0
SYMATTR InstName Q138
SYMATTR Value BC847B
SYMBOL npn -1664 17728 R0
SYMATTR InstName Q139
SYMATTR Value BC847B
SYMBOL Res -1264 17776 R0
SYMATTR InstName R74
SYMATTR Value 470
SYMBOL Res -1520 18048 R0
SYMATTR InstName R75
SYMATTR Value 100
SYMBOL npn -1808 17728 M0
SYMATTR InstName Q144
SYMATTR Value BC847B
SYMBOL npn -2032 17936 R0
SYMATTR InstName Q145
SYMATTR Value BC847B
SYMBOL npn -2128 17728 R0
SYMATTR InstName Q146
SYMATTR Value BC847B
SYMBOL Res -1984 18048 R0
SYMATTR InstName R77
SYMATTR Value 47
SYMBOL Res -1264 17936 R0
SYMATTR InstName R78
SYMATTR Value 30
SYMBOL npn 224 17712 M0
SYMATTR InstName Q154
SYMATTR Value BC847B
SYMBOL npn 0 17920 R0
SYMATTR InstName Q155
SYMATTR Value BC847B
SYMBOL npn -96 17712 R0
SYMATTR InstName Q156
SYMATTR Value BC847B
SYMBOL Res 48 18032 R0
SYMATTR InstName R73
SYMATTR Value 100
SYMBOL Cap 336 17696 R0
SYMATTR InstName C11
SYMATTR Value 300p
SYMBOL npn 2752 16704 M0
SYMATTR InstName Q1
SYMATTR Value BC847B
SYMBOL npn 2528 16912 R0
SYMATTR InstName Q2
SYMATTR Value BC847B
SYMBOL npn 2432 16704 R0
SYMATTR InstName Q3
SYMATTR Value BC847B
SYMBOL Res 2576 17024 R0
SYMATTR InstName R2
SYMATTR Value 100
SYMBOL pnp 2560 16224 R180
WINDOW 0 60 32 Left 2
WINDOW 3 58 66 Left 2
SYMATTR InstName Q4
SYMATTR Value BC857B
SYMBOL pnp 3008 16224 M180
WINDOW 0 64 34 Left 2
WINDOW 3 61 68 Left 2
SYMATTR InstName Q5
SYMATTR Value BC857B
SYMBOL pnp 3008 16384 M180
WINDOW 0 64 34 Left 2
WINDOW 3 61 68 Left 2
SYMATTR InstName Q7
SYMATTR Value BC857B
SYMBOL pnp 2752 16528 R180
WINDOW 0 60 32 Left 2
WINDOW 3 58 66 Left 2
SYMATTR InstName Q8
SYMATTR Value BC857B
SYMBOL pnp 2816 16528 M180
WINDOW 0 64 34 Left 2
WINDOW 3 61 68 Left 2
SYMATTR InstName Q9
SYMATTR Value BC857B
SYMBOL pnp 2816 16688 M180
WINDOW 0 64 34 Left 2
WINDOW 3 61 68 Left 2
SYMATTR InstName Q11
SYMATTR Value BC857B
SYMBOL npn 3008 16864 R0
SYMATTR InstName Q12
SYMATTR Value BC847B
SYMBOL npn 3008 17024 R0
SYMATTR InstName Q14
SYMATTR Value BC847B
SYMBOL npn 2944 17024 M0
SYMATTR InstName Q15
SYMATTR Value BC847B
SYMBOL Cap 3136 16576 R0
SYMATTR InstName C2
SYMATTR Value 20p
SYMBOL Res 3408 16608 R0
SYMATTR InstName R4
SYMATTR Value 2k
SYMBOL Res 3408 16800 R0
SYMATTR InstName R5
SYMATTR Value 10
SYMBOL npn 2336 16912 R0
SYMATTR InstName Q19
SYMATTR Value BC847B
SYMBOL Res 2384 17024 R0
SYMATTR InstName R6
SYMATTR Value 100
SYMBOL npn -1328 16464 M0
SYMATTR InstName Q22
SYMATTR Value BC847B
SYMBOL npn -1552 16672 R0
SYMATTR InstName Q23
SYMATTR Value BC847B
SYMBOL npn -1648 16464 R0
SYMATTR InstName Q24
SYMATTR Value BC847B
SYMBOL Res -1264 16432 R0
SYMATTR InstName R9
SYMATTR Value 470
SYMBOL Res -1504 16784 R0
SYMATTR InstName R10
SYMATTR Value 100
SYMBOL npn -1792 16464 M0
SYMATTR InstName Q29
SYMATTR Value BC847B
SYMBOL npn -2016 16672 R0
SYMATTR InstName Q30
SYMATTR Value BC847B
SYMBOL npn -2112 16464 R0
SYMATTR InstName Q31
SYMATTR Value BC847B
SYMBOL Res -1968 16784 R0
SYMATTR InstName R12
SYMATTR Value 47
SYMBOL Res -1264 16656 R0
SYMATTR InstName R13
SYMATTR Value 30
SYMBOL MCP6021 512 17648 R0
SYMATTR InstName U1
SYMBOL MCP6021 496 16400 R0
SYMATTR InstName U2
SYMBOL MCP6021 3296 16528 R0
SYMATTR InstName U3
SYMBOL Res 592 16544 R0
SYMATTR InstName R3
SYMATTR Value 150
SYMBOL Res 592 16688 R0
SYMATTR InstName R8
SYMATTR Value 150
SYMBOL npn 2128 16912 R0
SYMATTR InstName Q16
SYMATTR Value BC847B
SYMBOL Res 2176 17024 R0
SYMATTR InstName R7
SYMATTR Value 100
SYMBOL npn 1920 16912 R0
SYMATTR InstName Q17
SYMATTR Value BC847B
SYMBOL Res 1968 17024 R0
SYMATTR InstName R11
SYMATTR Value 100
SYMBOL Res 592 17728 R0
SYMATTR InstName R19
SYMATTR Value 150
SYMBOL Res 592 17936 R0
SYMATTR InstName R20
SYMATTR Value 150
SYMBOL npn 3232 18048 M0
SYMATTR InstName Q10
SYMATTR Value BC847B
SYMBOL npn 3008 18256 R0
SYMATTR InstName Q13
SYMATTR Value BC847B
SYMBOL npn 2912 18048 R0
SYMATTR InstName Q20
SYMATTR Value BC847B
SYMBOL Res 3056 18368 R0
SYMATTR InstName R14
SYMATTR Value 100
SYMBOL pnp 3040 17696 R180
WINDOW 0 60 32 Left 2
WINDOW 3 58 66 Left 2
SYMATTR InstName Q21
SYMATTR Value BC857B
SYMBOL pnp 3104 17696 M180
WINDOW 0 64 34 Left 2
WINDOW 3 61 68 Left 2
SYMATTR InstName Q32
SYMATTR Value BC857B
SYMBOL pnp 3040 17856 R180
WINDOW 0 60 32 Left 2
WINDOW 3 58 66 Left 2
SYMATTR InstName Q33
SYMATTR Value BC857B
SYMBOL pnp 3104 17856 M180
WINDOW 0 64 34 Left 2
WINDOW 3 61 68 Left 2
SYMATTR InstName Q36
SYMATTR Value BC857B
SYMBOL npn 1248 18608 M0
SYMATTR InstName Q42
SYMATTR Value BC847B
SYMBOL current 1184 18336 R0
SYMATTR InstName I2
SYMATTR Value 400µ
SYMBOL npn 1216 18512 R0
SYMATTR InstName Q44
SYMATTR Value BC847B
SYMBOL Res 1168 18720 R0
SYMATTR InstName R18
SYMATTR Value 100
SYMBOL Cap 1264 18720 R0
SYMATTR InstName C3
SYMATTR Value 1n
SYMBOL ind 2688 18112 R0
SYMATTR InstName L2
SYMATTR Value 2m
SYMATTR SpiceLine Rser=10 Cpar=1p
SYMBOL Cap 2416 17936 R90
WINDOW 0 0 32 VBottom 2
WINDOW 3 32 32 VTop 2
SYMATTR InstName C4
SYMATTR Value 20p
SYMBOL Res 2688 17968 R0
SYMATTR InstName R26
SYMATTR Value 200
SYMBOL npn 3936 18256 R0
SYMATTR InstName Q45
SYMATTR Value BC847B
SYMBOL Res 3984 18368 R0
SYMATTR InstName R21
SYMATTR Value 100
SYMBOL npn 3936 17856 R0
SYMATTR InstName Q46
SYMATTR Value BC847B
SYMBOL npn 3696 18048 M0
SYMATTR InstName Q47
SYMATTR Value BC847B
SYMBOL npn 3472 18256 R0
SYMATTR InstName Q48
SYMATTR Value BC847B
SYMBOL npn 3376 18048 R0
SYMATTR InstName Q49
SYMATTR Value BC847B
SYMBOL Res 3520 18368 R0
SYMATTR InstName R23
SYMATTR Value 100
SYMBOL npn 4688 18048 M0
SYMATTR InstName Q50
SYMATTR Value BC847B
SYMBOL npn 4464 18256 R0
SYMATTR InstName Q51
SYMATTR Value BC847B
SYMBOL npn 4368 18048 R0
SYMATTR InstName Q56
SYMATTR Value BC847B
SYMBOL Res 4512 18368 R0
SYMATTR InstName R24
SYMATTR Value 100
SYMBOL pnp 4496 17696 R180
WINDOW 0 60 32 Left 2
WINDOW 3 58 66 Left 2
SYMATTR InstName Q57
SYMATTR Value BC857B
SYMBOL pnp 4560 17696 M180
WINDOW 0 64 34 Left 2
WINDOW 3 61 68 Left 2
SYMATTR InstName Q58
SYMATTR Value BC857B
SYMBOL pnp 4496 17856 R180
WINDOW 0 60 32 Left 2
WINDOW 3 58 66 Left 2
SYMATTR InstName Q59
SYMATTR Value BC857B
SYMBOL pnp 4560 17856 M180
WINDOW 0 64 34 Left 2
WINDOW 3 61 68 Left 2
SYMATTR InstName Q60
SYMATTR Value BC857B
SYMBOL Res 4800 18112 R0
SYMATTR InstName R27
SYMATTR Value 20
SYMBOL Res 4800 17968 R0
SYMATTR InstName R28
SYMATTR Value 360
SYMBOL npn 4944 18288 R0
SYMATTR InstName Q61
SYMATTR Value BC847B
SYMBOL Res 4992 18400 R0
SYMATTR InstName R29
SYMATTR Value 100
SYMBOL npn 4944 17888 R0
SYMATTR InstName Q62
SYMATTR Value BC847B
SYMBOL Res 4160 18272 R0
SYMATTR InstName R22
SYMATTR Value 200
SYMBOL Res 4160 18128 R0
SYMATTR InstName R25
SYMATTR Value 10
SYMBOL Cap 2592 18112 R0
SYMATTR InstName C5
SYMATTR Value 20p
SYMBOL Res 2480 17968 R0
SYMATTR InstName R30
SYMATTR Value 470k
SYMBOL npn -288 16464 M0
SYMATTR InstName Q63
SYMATTR Value BC847B
SYMBOL npn -512 16672 R0
SYMATTR InstName Q64
SYMATTR Value BC847B
SYMBOL npn -608 16464 R0
SYMATTR InstName Q65
SYMATTR Value BC847B
SYMBOL Res -464 16784 R0
SYMATTR InstName R31
SYMATTR Value 100
SYMBOL Cap -256 16128 R0
SYMATTR InstName C6
SYMATTR Value 470p
SYMBOL npn -288 17712 M0
SYMATTR InstName Q70
SYMATTR Value BC847B
SYMBOL npn -512 17920 R0
SYMATTR InstName Q71
SYMATTR Value BC847B
SYMBOL npn -608 17712 R0
SYMATTR InstName Q72
SYMATTR Value BC847B
SYMBOL Res -464 18032 R0
SYMATTR InstName R32
SYMATTR Value 100
SYMBOL Cap -256 17376 R0
SYMATTR InstName C7
SYMATTR Value 470p
SYMBOL npn -704 16464 M0
SYMATTR InstName Q77
SYMATTR Value BC847B
SYMBOL npn -928 16672 R0
SYMATTR InstName Q78
SYMATTR Value BC847B
SYMBOL npn -1024 16464 R0
SYMATTR InstName Q79
SYMATTR Value BC847B
SYMBOL Res -880 16784 R0
SYMATTR InstName R33
SYMATTR Value 100
SYMBOL npn -720 17712 M0
SYMATTR InstName Q80
SYMATTR Value BC847B
SYMBOL npn -944 17920 R0
SYMATTR InstName Q81
SYMATTR Value BC847B
SYMBOL npn -1040 17712 R0
SYMATTR InstName Q82
SYMATTR Value BC847B
SYMBOL Res -896 18032 R0
SYMATTR InstName R34
SYMATTR Value 100
SYMBOL pnp -1024 15792 R180
WINDOW 0 60 32 Left 2
WINDOW 3 58 66 Left 2
SYMATTR InstName Q6
SYMATTR Value BC857B
SYMBOL pnp -960 15792 M180
WINDOW 0 64 34 Left 2
WINDOW 3 61 68 Left 2
SYMATTR InstName Q40
SYMATTR Value BC857B
SYMBOL pnp -1024 15952 R180
WINDOW 0 60 32 Left 2
WINDOW 3 58 66 Left 2
SYMATTR InstName Q75
SYMATTR Value BC857B
SYMBOL pnp -960 15952 M180
WINDOW 0 64 34 Left 2
WINDOW 3 61 68 Left 2
SYMATTR InstName Q83
SYMATTR Value BC857B
SYMBOL pnp -1520 16128 R180
WINDOW 0 60 32 Left 2
WINDOW 3 58 66 Left 2
SYMATTR InstName Q18
SYMATTR Value BC857B
SYMBOL pnp -1456 16128 M180
WINDOW 0 64 34 Left 2
WINDOW 3 61 68 Left 2
SYMATTR InstName Q25
SYMATTR Value BC857B
SYMBOL pnp -1520 16288 R180
WINDOW 0 60 32 Left 2
WINDOW 3 58 66 Left 2
SYMATTR InstName Q26
SYMATTR Value BC857B
SYMBOL pnp -1456 16288 M180
WINDOW 0 64 34 Left 2
WINDOW 3 61 68 Left 2
SYMATTR InstName Q27
SYMATTR Value BC857B
SYMBOL pnp -480 16128 R180
WINDOW 0 60 32 Left 2
WINDOW 3 58 66 Left 2
SYMATTR InstName Q34
SYMATTR Value BC857B
SYMBOL pnp -416 16128 M180
WINDOW 0 64 34 Left 2
WINDOW 3 61 68 Left 2
SYMATTR InstName Q35
SYMATTR Value BC857B
SYMBOL pnp -480 16288 R180
WINDOW 0 60 32 Left 2
WINDOW 3 58 66 Left 2
SYMATTR InstName Q37
SYMATTR Value BC857B
SYMBOL pnp -416 16288 M180
WINDOW 0 64 34 Left 2
WINDOW 3 61 68 Left 2
SYMATTR InstName Q43
SYMATTR Value BC857B
SYMBOL pnp 32 16128 R180
WINDOW 0 60 32 Left 2
WINDOW 3 58 66 Left 2
SYMATTR InstName Q66
SYMATTR Value BC857B
SYMBOL pnp 96 16128 M180
WINDOW 0 64 34 Left 2
WINDOW 3 61 68 Left 2
SYMATTR InstName Q67
SYMATTR Value BC857B
SYMBOL pnp 32 16288 R180
WINDOW 0 60 32 Left 2
WINDOW 3 58 66 Left 2
SYMATTR InstName Q68
SYMATTR Value BC857B
SYMBOL pnp 96 16288 M180
WINDOW 0 64 34 Left 2
WINDOW 3 61 68 Left 2
SYMATTR InstName Q69
SYMATTR Value BC857B
SYMBOL pnp -1536 17360 R180
WINDOW 0 60 32 Left 2
WINDOW 3 58 66 Left 2
SYMATTR InstName Q28
SYMATTR Value BC857B
SYMBOL pnp -1472 17360 M180
WINDOW 0 64 34 Left 2
WINDOW 3 61 68 Left 2
SYMATTR InstName Q38
SYMATTR Value BC857B
SYMBOL pnp -1536 17520 R180
WINDOW 0 60 32 Left 2
WINDOW 3 58 66 Left 2
SYMATTR InstName Q39
SYMATTR Value BC857B
SYMBOL pnp -1472 17520 M180
WINDOW 0 64 34 Left 2
WINDOW 3 61 68 Left 2
SYMATTR InstName Q41
SYMATTR Value BC857B
SYMBOL pnp -480 17376 R180
WINDOW 0 60 32 Left 2
WINDOW 3 58 66 Left 2
SYMATTR InstName Q73
SYMATTR Value BC857B
SYMBOL pnp -416 17376 M180
WINDOW 0 64 34 Left 2
WINDOW 3 61 68 Left 2
SYMATTR InstName Q74
SYMATTR Value BC857B
SYMBOL pnp -480 17536 R180
WINDOW 0 60 32 Left 2
WINDOW 3 58 66 Left 2
SYMATTR InstName Q76
SYMATTR Value BC857B
SYMBOL pnp -416 17536 M180
WINDOW 0 64 34 Left 2
WINDOW 3 61 68 Left 2
SYMATTR InstName Q84
SYMATTR Value BC857B
SYMBOL pnp 32 17360 R180
WINDOW 0 60 32 Left 2
WINDOW 3 58 66 Left 2
SYMATTR InstName Q85
SYMATTR Value BC857B
SYMBOL pnp 96 17360 M180
WINDOW 0 64 34 Left 2
WINDOW 3 61 68 Left 2
SYMATTR InstName Q86
SYMATTR Value BC857B
SYMBOL pnp 32 17520 R180
WINDOW 0 60 32 Left 2
WINDOW 3 58 66 Left 2
SYMATTR InstName Q87
SYMATTR Value BC857B
SYMBOL pnp 96 17520 M180
WINDOW 0 64 34 Left 2
WINDOW 3 61 68 Left 2
SYMATTR InstName Q88
SYMATTR Value BC857B
TEXT -440 13760 Left 2 !.tran 0 12m 0n 10n
TEXT 408 13712 Left 4 ;Wide frequency range VCO for Theremin AFE
TEXT 2832 14048 Left 2 !.ic V(RC1)=2.251\n.ic V(RC2)=2.252\n.ic V(INT1)=2.82
TEXT 2800 13984 Left 4 ;Amplitude limiter
TEXT 2504 14256 Left 3 ;Unity gain output buffer - operational amplifier with current feedback
TEXT -560 15800 Left 2 !.ic V(PP1)=2.25\n.ic V(PP2)=2.255\n.ic V(PP3)=2.25\n.ic V(PP4)=2.253
TEXT -2112 17368 Left 4 ;Non-Inverting amplifier\namplitude limiter
TEXT -2008 16128 Left 4 ;Inverting amplifier\namplitude limiter
TEXT 2176 17768 Left 2 !.ic V(LC1)=2.26\n.ic V(LC2)=2.2501\n.ic I(L2)=0.001m

The netlist it stands for:
* vco_sine_bjt_v09.asc
V1 COM 0 4.5
V2 VREF 0 2.25
V19 VCC33 0 3.3
V4 VREF12 0 1.2
Q52 N001 VCOBIAS1 N002 0 BC847B
R60 COM VCOBIAS2 22k
R1 COM VCOBIAS3 4.7k
I1 COM N001 PWL(0 40u 400u 40u 8m 300u)
Q54 VCOBIAS2 VCOBIAS2 N004 0 BC847B
Q55 VCOBIAS3 VCOBIAS3 N005 0 BC847B
Q53 COM N001 VCOBIAS1 0 BC847B
R15 N002 0 100
R16 N005 0 100
R17 N004 0 100
C1 NC_01 0 1n
R40 COM VCOBIAS22 22k
Q125 VCOBIAS22 VCOBIAS22 N003 0 BC847B
R41 N003 0 100
L1 DRIVE ANT 2mH Rser=120 Cpar=1pF
C_ant1 ANT 0 10pF
R66 VCOOUT DRIVE 4.7
Q128 PP2 PP2 N026 0 BC847B
Q129 N026 VCOBIAS1 N033 0 BC847B
Q130 N018 PP1 N026 0 BC847B
R70 N033 0 100
C8 PP2 0 300p
Q137 LIM2 VREF N061 0 BC847B
Q138 N061 VCOBIAS2 N068 0 BC847B
Q139 N047 LPOUT1 N061 0 BC847B
R74 LIM2 N054 470
R75 N068 0 100
Q144 LIM2 N054 N060 0 BC847B
Q145 N060 VCOBIAS1 N067 0 BC847B
Q146 N047 VREF N060 0 BC847B
R77 N067 0 47
R78 N054 VREF 30
Q154 PP4 PP4 N059 0 BC847B
Q155 N059 VCOBIAS1 N066 0 BC847B
Q156 N048 PP3 N059 0 BC847B
R73 N066 0 100
C11 PP4 0 300p
Q1 N027 N028 N034 0 BC847B
Q2 N034 VCOBIAS1 N040 0 BC847B
Q3 N019 LPOUT1 N034 0 BC847B
R2 N040 0 100
Q4 N019 N012 COM 0 BC857B
Q5 N012 N012 COM 0 BC857B
Q7 AMP1 N019 N012 0 BC857B
Q8 N027 N020 COM 0 BC857B
Q9 N020 N020 COM 0 BC857B
Q11 N035 N027 N020 0 BC857B
Q12 AMP1 N035 N036 0 BC847B
Q14 N036 N036 0 0 BC847B
Q15 N035 N036 0 0 BC847B
C2 AMP1 0 20p
R4 VCOOUT N028 2k
R5 N028 VREF 10
Q19 N034 VCOBIAS1 N039 0 BC847B
R6 N039 0 100
Q22 LIM1 LPOUT2 N023 0 BC847B
Q23 N023 VCOBIAS2 N030 0 BC847B
Q24 N016 VREF N023 0 BC847B
R9 LIM1 N021 470
R10 N030 0 100
Q29 LIM1 N021 N022 0 BC847B
Q30 N022 VCOBIAS1 N029 0 BC847B
Q31 N016 VREF N022 0 BC847B
R12 N029 0 47
R13 N021 VREF 30
XU1 PP4 LPOUT2 COM 0 LPOUT2 MCP6021  ; pins In+ In- V+ V- OUT
XU2 PP2 LPOUT1 COM 0 LPOUT1 MCP6021  ; pins In+ In- V+ V- OUT
XU3 AMP1 VCOOUT COM 0 VCOOUT MCP6021  ; pins In+ In- V+ V- OUT
R3 NC_02 LPOUT1A 150
R8 LPOUT1A VREF 150
Q16 N034 VCOBIAS1 N038 0 BC847B
R7 N038 0 100
Q17 N034 VCOBIAS1 N037 0 BC847B
R11 N037 0 100
R19 NC_03 LPOUT2A 150
R20 LPOUT2A VREF 150
Q10 N062 N069 N073 0 BC847B
Q13 N073 VCOBIAS0 N076 0 BC847B
Q20 N055 LC2 N073 0 BC847B
R14 N076 0 100
Q21 N052 N050 COM 0 BC857B
Q32 N050 N050 COM 0 BC857B
Q33 N055 N055 N052 0 BC857B
Q36 N062 N055 N050 0 BC857B
Q42 N081 VCOBIAS0 N082 0 BC847B
I2 COM N081 400µ
Q44 COM N081 VCOBIAS0 0 BC847B
R18 N082 0 100
C3 NC_04 0 1n
L2 N069 VREF 2m Rser=10 Cpar=1p
C4 LC2 LC1 20p
R26 LC2 N069 200
Q45 N071 VCOBIAS0 N078 0 BC847B
R21 N078 0 100
Q46 COM N062 N071 0 BC847B
Q47 N062 N070 N074 0 BC847B
Q48 N074 VCOBIAS0 N077 0 BC847B
Q49 N055 VREF N074 0 BC847B
R23 N077 0 100
Q50 N063 N072 N075 0 BC847B
Q51 N075 VCOBIAS0 N079 0 BC847B
Q56 N056 N071 N075 0 BC847B
R24 N079 0 100
Q57 N053 N051 COM 0 BC857B
Q58 N051 N051 COM 0 BC857B
Q59 N056 N056 N053 0 BC857B
Q60 N063 N056 N051 0 BC857B
R27 N072 VREF 20
R28 N063 N072 360
Q61 LC1 VCOBIAS0 N080 0 BC847B
R29 N080 0 100
Q62 COM N063 LC1 0 BC847B
R22 N070 VREF 200
R25 N071 N070 10
C5 NC_05 VREF 20p
R30 LC2 VREF 470k
Q63 PP1 PP1 N025 0 BC847B
Q64 N025 VCOBIAS1 N032 0 BC847B
Q65 N017 PP2 N025 0 BC847B
R31 N032 0 100
C6 LPOUT1 PP1 470p
Q70 PP3 PP3 N058 0 BC847B
Q71 N058 VCOBIAS1 N065 0 BC847B
Q72 N049 PP4 N058 0 BC847B
R32 N065 0 100
C7 LPOUT2 PP3 470p
Q77 PP1 PP1 N024 0 BC847B
Q78 N024 VCOBIAS1 N031 0 BC847B
Q79 N017 LIM1 N024 0 BC847B
R33 N031 0 100
Q80 PP3 PP3 N057 0 BC847B
Q81 N057 VCOBIAS1 N064 0 BC847B
Q82 N049 LIM2 N057 0 BC847B
R34 N064 0 100
Q6 N007 N006 COM 0 BC857B
Q40 N006 N006 COM 0 BC857B
Q75 N008 N008 N007 0 BC857B
Q83 NC_06 N008 N006 0 BC857B
Q18 N013 N009 COM 0 BC857B
Q25 N009 N009 COM 0 BC857B
Q26 N016 N016 N013 0 BC857B
Q27 LIM1 N016 N009 0 BC857B
Q34 N014 N010 COM 0 BC857B
Q35 N010 N010 COM 0 BC857B
Q37 N017 N017 N014 0 BC857B
Q43 PP1 N017 N010 0 BC857B
Q66 N015 N011 COM 0 BC857B
Q67 N011 N011 COM 0 BC857B
Q68 N018 N018 N015 0 BC857B
Q69 PP2 N018 N011 0 BC857B
Q28 N044 N041 COM 0 BC857B
Q38 N041 N041 COM 0 BC857B
Q39 N047 N047 N044 0 BC857B
Q41 LIM2 N047 N041 0 BC857B
Q73 N046 N043 COM 0 BC857B
Q74 N043 N043 COM 0 BC857B
Q76 N049 N049 N046 0 BC857B
Q84 PP3 N049 N043 0 BC857B
Q85 N045 N042 COM 0 BC857B
Q86 N042 N042 COM 0 BC857B
Q87 N048 N048 N045 0 BC857B
Q88 PP4 N048 N042 0 BC857B
.model NPN NPN
.model PNP PNP
.lib standard.bjt
.tran 0 12m 0n 10n
* Wide frequency range VCO for Theremin AFE
.ic V(RC1)=2.251
.ic V(RC2)=2.252
.ic V(INT1)=2.82
* Amplitude limiter
* Unity gain output buffer - operational amplifier with current feedback
.ic V(PP1)=2.25
.ic V(PP2)=2.255
.ic V(PP3)=2.25
.ic V(PP4)=2.253
* Non-Inverting amplifier
* amplitude limiter
* Inverting amplifier
* amplitude limiter
.ic V(LC1)=2.26
.ic V(LC2)=2.2501
.ic I(L2)=0.001m
.lib MCP6021.cir
.backanno
.end